# Altium schematic sheet TM2_MAIN.SchDoc
size A; DrawnBy: Eduardo
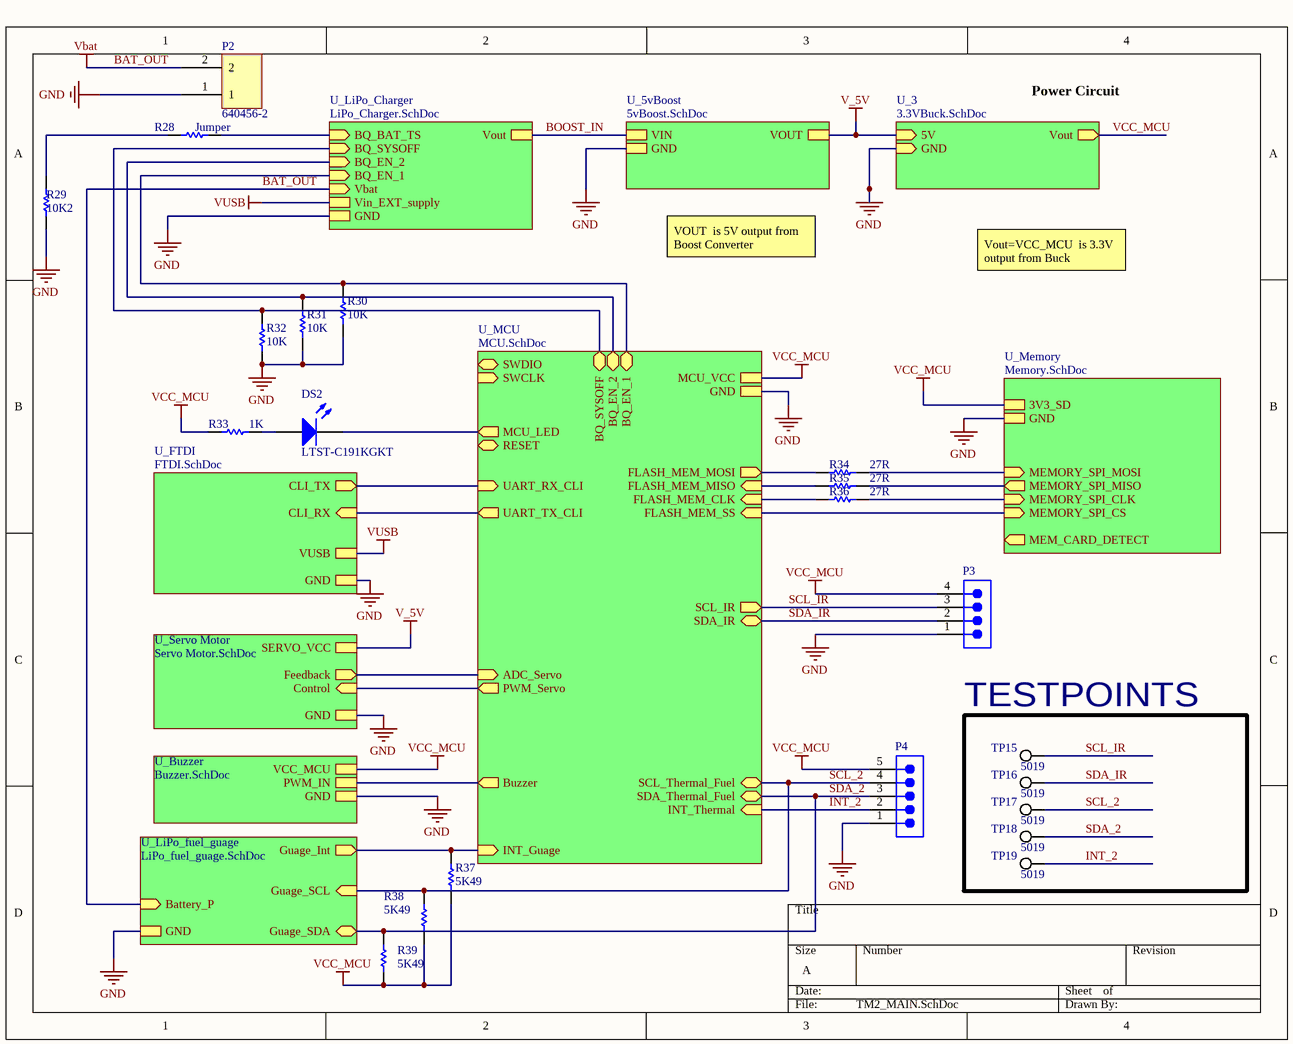
[diagram p0: TM2_MAIN.SchDoc]

## Parts
DS2  LTST-C191KGKT  [LITE-ON-LTST-C191KRKT-2_V]
P2  640456-2  [640456-2]
P3  (no value)  [SMTC-MTSW-104-07-X-S-170]
P4  (no value)  [SMTC-MTLW-105-05-X-S-190]
R28  Jumper  [RESC0603(1608)_N]
R29  10K2  [RESC0805(2012)_L]
R30  10K  [RESC0805(2012)_L]
R31  10K  [RESC0805(2012)_L]
R32  10K  [RESC0805(2012)_L]
R33  1K  [RESC0603(1608)_M]
R34  27R  [RESC0603(1608)_N]
R35  27R  [RESC0603(1608)_N]
R36  27R  [RESC0603(1608)_N]
R37  5K49  [RESC0805(2012)_N]
R38  5K49  [RESC0805(2012)_N]
R39  5K49  [RESC0805(2012)_N]
TP15  5019  [KSTN-5019_V]
TP16  5019  [KSTN-5019_V]
TP17  5019  [KSTN-5019_V]
TP18  5019  [KSTN-5019_V]
TP19  5019  [KSTN-5019_V]

## Blocks framed on the sheet
TESTPOINTS: TP15-TP19

## Sub-sheets
U_3 = 3.3VBuck.SchDoc: 5V (in), GND (in), Vout (out)
U_5vBoost = 5vBoost.SchDoc: VOUT, VIN, GND
U_Buzzer = Buzzer.SchDoc: VCC_MCU, GND, PWM_IN
U_FTDI = FTDI.SchDoc: CLI_RX (in), CLI_TX (out), VUSB, GND
U_LiPo_Charger = LiPo_Charger.SchDoc: BQ_BAT_TS (in), BQ_SYSOFF (in), BQ_EN_2 (in), BQ_EN_1 (in), Vbat (in), Vout, GND, Vin_EXT_supply
U_LiPo_fuel_guage = LiPo_fuel_guage.SchDoc: Guage_SDA (bidir), Guage_SCL (in), Guage_Int (out), Battery_P (in), GND
U_MCU = MCU.SchDoc: SWDIO (bidir), SWCLK (in), UART_TX_CLI (out), FLASH_MEM_SS (in), FLASH_MEM_CLK (in), FLASH_MEM_MISO (in), FLASH_MEM_MOSI (out), RESET (bidir), MCU_LED (out), MCU_VCC, GND, INT_Thermal (in), SDA_IR (bidir), PWM_Servo (out), ADC_Servo (in), SCL_Thermal_Fuel (bidir), SDA_Thermal_Fuel (bidir), SCL_IR (out), UART_RX_CLI (in), BQ_SYSOFF (bidir), BQ_EN_1 (bidir), BQ_EN_2 (bidir), INT_Guage (in), Buzzer (out)
U_Memory = Memory.SchDoc: MEMORY_SPI_MOSI (in), MEMORY_SPI_MISO (out), MEMORY_SPI_CLK (in), MEMORY_SPI_CS (in), MEM_CARD_DETECT (out), GND, 3V3_SD
U_Servo Motor = Servo Motor.SchDoc: SERVO_VCC, Feedback (out), Control (in), GND

## Nets
BAT_OUT: P2.2 ; sheet U_LiPo_Charger/Vbat, sheet U_LiPo_fuel_guage/Battery_P  [also labelled Vbat]
GND: P2.1 P3.1 P4.1 R29.1 R30.1 R31.2 R32.2 ; sheet U_FTDI/GND, sheet U_Memory/GND, sheet U_5vBoost/GND, sheet U_3/GND, sheet U_MCU/GND, sheet U_Servo Motor/GND, sheet U_LiPo_Charger/GND, sheet U_LiPo_fuel_guage/GND, sheet U_Buzzer/GND
V_5V: sheet U_5vBoost/VOUT, sheet U_3/5V, sheet U_Servo Motor/SERVO_VCC
VCC_MCU: P3.4 P4.5 R33.1 R37.1 R38.1 R39.1 ; sheet U_Memory/3V3_SD, sheet U_3/Vout, sheet U_MCU/MCU_VCC, sheet U_Buzzer/VCC_MCU
VUSB: sheet U_FTDI/VUSB, sheet U_LiPo_Charger/Vin_EXT_supply
BOOST_IN: sheet U_5vBoost/VIN, sheet U_LiPo_Charger/Vout
INT_2: P4.2 TP19.1 ; sheet U_MCU/INT_Thermal
SCL_2: P4.4 R38.2 TP17.1 ; sheet U_MCU/SCL_Thermal_Fuel, sheet U_LiPo_fuel_guage/Guage_SCL
SCL_IR: P3.3 TP15.1 ; sheet U_MCU/SCL_IR
SDA_2: P4.3 R39.2 TP18.1 ; sheet U_MCU/SDA_Thermal_Fuel, sheet U_LiPo_fuel_guage/Guage_SDA
SDA_IR: P3.2 TP16.1 ; sheet U_MCU/SDA_IR
NetDS2_1: DS2.1(A) R33.2
NetDS2_2: DS2.2(K) ; sheet U_MCU/MCU_LED
NetR28_1: R28.1 R29.2
NetR28_2: R28.2 ; sheet U_LiPo_Charger/BQ_BAT_TS
NetR30_2: R30.2 ; sheet U_MCU/BQ_EN_1, sheet U_LiPo_Charger/BQ_EN_1
NetR31_1: R31.1 ; sheet U_MCU/BQ_EN_2, sheet U_LiPo_Charger/BQ_EN_2
NetR32_1: R32.1 ; sheet U_MCU/BQ_SYSOFF, sheet U_LiPo_Charger/BQ_SYSOFF
NetR34_1: R34.1 ; sheet U_MCU/FLASH_MEM_MOSI
NetR34_2: R34.2 ; sheet U_Memory/MEMORY_SPI_MOSI
NetR35_1: R35.1 ; sheet U_MCU/FLASH_MEM_MISO
NetR35_2: R35.2 ; sheet U_Memory/MEMORY_SPI_MISO
NetR36_1: R36.1 ; sheet U_MCU/FLASH_MEM_CLK
NetR36_2: R36.2 ; sheet U_Memory/MEMORY_SPI_CLK
NetR37_2: R37.2 ; sheet U_MCU/INT_Guage, sheet U_LiPo_fuel_guage/Guage_Int
(unnamed): sheet U_FTDI/CLI_RX, sheet U_MCU/UART_TX_CLI
(unnamed): sheet U_FTDI/CLI_TX, sheet U_MCU/UART_RX_CLI
(unnamed): sheet U_Memory/MEMORY_SPI_CS, sheet U_MCU/FLASH_MEM_SS
(unnamed): sheet U_MCU/PWM_Servo, sheet U_Servo Motor/Control
(unnamed): sheet U_MCU/ADC_Servo, sheet U_Servo Motor/Feedback
(unnamed): sheet U_MCU/Buzzer, sheet U_Buzzer/PWM_IN

## Notes on the sheet
- Power Circuit
- VOUT  is 5V output from Boost Converter
- Vout=VCC_MCU  is 3.3V output from Buck Converter

## Library data of the parts
DS2 = CMP-2000-05198-1: Chip LED, Green, 574 nm, 40 pF, -55 to 85 degC, 2-Pin SMD, RoHS, Tape and Reel; Manufacturer: Lite-On; Rad Hardened: No; Emitting Color: YellowGreen; Product Height (mm): 0.55mm; Forward Voltage: 2.4V; Number of Elements: 1; Dominant Wave Length: 571nm; DELETED: Compliant; Viewing Angle: 130deg; High Brightness: Yes; Peak Wavelength: 574nm; Type: Uni-Color; Forward Current: 30mA; Product Length (mm): 1.6mm; Luminous Intensity: 35mcd; Test Current (It): 20mA; Chip Material: AlGaInP; Product Depth (mm): 0.8mm; Shape Type: Rectangular; Reverse Voltage: 5V; Power Dissipation: 75W; Pin Count: 2; Lens Dimensions: 1.1X0.8X0.37mm; Packaging: TapeandReel; Main Category: ChipLED; Operating Temperature Classification: Industrial; Package Type: ChipLed; Mounting: SurfaceMount; Lum Intensity: 35mcd; Operating Temp Range: -55Cto85C; Datasheet Version: Jan-07; Datasheet URL: http://download.siliconexpert.com/pdfs/2007/08/26/semi_b/manual/lot/ds/ltst-c191kgkt.pdf; Manufacturer URL: http://www.us.liteon.com/
P2 = 640456-2: CONN HEADER VERT 2POS .100 TIN; Manufacturer: TE Connectivity; Underplate Material: Nickel; Connector Type: Plug,Pin,Header; Contact Resistance: 6mR; Max Current Rating: 5A; Max Voltage Rating (AC): 250V; Number of Positions: 2; Backwall/Post Interruptions: No (Without); Connector System: Wire-to-Board; Plating Thickness: 3.81um; PCB Mount Retention: Without; Gender: Male; Contact Style: Straight; PCB Mounting Orientation: Vertical; Pitch: 2.54mm; Mating Post Length: 7.49mm; PCB Thickness: 0.063inch; Tail Length: 3.56mm; Approvals: CSA; Supplier 1: Digi-Key; Manufacturer Part Number: 640456-2; Stock 1: 141304; Pricing 1: 1=0.12, 10=0.117, 100=0.0724, 500=0.0599, 1000=0.0524, 5000=0.0449, 10000=0.0437 (USD); Mount: Through Hole; Colour: White,Natural,Beige; Contact Plating: Tin; Contact Material: Copper Alloy; Housing Colour: Natural; Housing Material: Polyester; Contact Shape: Square; Min Operating Temperature: -67°C; Max Operating Temperature: 221°C; Package Quantity: 5000; Packaging: Bulk; Termination: Solder; Number of Rows: 1; Fastening Type: Friction; Contact Gender: Male; Voltage Rating (AC): 250V; Number of Contacts: 2; Orientation: Straight; Contact Retention: No (Without); Mating Alignment: No (Without); Mating Retention: No (Without); PCB Mount Alignment: No (Without); Panel Mount Retention: No (Without); Sealable: No (Without); Strain Relief: No (Without); Current Rating: 5A; Number of Poles: 2; Voltage Rating: 250V; Working Voltage: 250V; Length: 5.08mm; Height: 7.87mm; Depth: 5.72mm; Lead Pitch: 2.54mm; Contact Mating Length: 0.295inch; Termination Post Length: 3.56mm; Radiation Hardening: No; ELV: Compliant; Lead Free: Lead Free; Flammability Rating: UL94 V-0; REACH SVHC: No SVHC; ComponentLink1URL: https://datasheet.ciiva.com/709/eng-cd-640456-w1-709680.pdf; ComponentLink1Description: https://datasheet.ciiva.com/709/eng-cd-640456-w1-709680.pdf; ComponentLink2URL: https://datasheet.ciiva.com/3118/eng-ds-82056-mta-0608-3118497.pdf; ComponentLink2Description: https://datasheet.ciiva.com/3118/eng-ds-82056-mta-0608-3118497.pdf; ComponentLink3URL: https://datasheet.ciiva.com/19462/613931-19462481.pdf; ComponentLink3Description: https://datasheet.ciiva.com/19462/613931-19462481.pdf; ComponentLink4URL: https://datasheet.ciiva.com/14156/04384301-14156820.pdf; ComponentLink4Description: https://datasheet.ciiva.com/14156/04384301-14156820.pdf; ComponentLink5URL: https://datasheet.ciiva.com/7128/1866390-7128742.pdf; ComponentLink5Description: https://datasheet.ciiva.com/7128/1866390-7128742.pdf; ComponentLink6URL: https://datasheet.ciiva.com/16401/eng-ds-82056-mta-0608-16401289.pdf; ComponentLink6Description: https://datasheet.ciiva.com/16401/eng-ds-82056-mta-0608-16401289.pdf; ComponentLink7URL: https://datasheet.ciiva.com/16505/eng-ds-82056-mta-0608-16505419.pdf; ComponentLink7Description: https://datasheet.ciiva.com/16505/eng-ds-82056-mta-0608-16505419.pdf; ComponentLink8URL: https://datasheet.ciiva.com/25617/0900766b80027008-25617244.pdf; ComponentLink8Description: https://datasheet.ciiva.com/25617/0900766b80027008-25617244.pdf; ComponentLink9URL: https://datasheet.ciiva.com/11746/0900766b80eb7fdd-11746365.pdf; ComponentLink9Description: https://datasheet.ciiva.com/11746/0900766b80eb7fdd-11746365.pdf; Supplier Part Number 1: A1921-ND
P3 = CMP-1024-00107-1: Manufacturer: Samtec; PartNumber: MTSW-104-07-L-S-170; Pitch: 2.54 mm; PackageVersion: BI, 2/1987; ComponentLink1URL: http://www.samtec.com; PackageReference: MTSW-104-07-X-S-170; ComponentLink3Description: Package Specification; Temperature Range: -55 to 125 degC; ComponentLink2URL: http://www.samtec.com/documents/webfiles/pdf/MTSW.PDF; RoHS: True; Orientation: Vertical; DatasheetVersion: F-214; Mounting Technology: Through-hole; ComponentLink1Description: Manufacturer URL; ComponentLink2Description: Datasheet; ComponentLink3URL: http://www.samtec.com/documents/webfiles/cpdf/MTSW-XXX-XX-X-X-XXXX-XX-XXX-MKT1.pdf
P4 = CMP-1024-00079-1: Manufacturer: Samtec; PartNumber: MTLW-105-05-L-S-190; Pitch: 2.54 mm; Mounting Technology: Through-hole; ComponentLink2Description: Datasheet; DatasheetVersion: F-214; Temperature Range: -55 to 125 degC; ComponentLink1Description: Manufacturer URL; Orientation: Vertical; ComponentLink2URL: http://www.samtec.com/documents/webfiles/pdf/MTLW_TH.PDF; PackageDescription: Low Profile Terminal Assembly; PackageVersion: T, 6/1991; RoHS: True; ComponentLink3Description: Package Specification; ComponentLink1URL: http://www.samtec.com; PackageReference: MTLW-105-05-X-S-190; ComponentLink3URL: http://www.samtec.com/documents/webfiles/cpdf/MTLW-1XX-XX-XX-X-XXX-XX-XX-MKT1.pdf
R28 = CMP-1012-00001-1: Jumper 0603 (1608 Metric); Case-Metric: 1608; Value: 0.00 Ohm; Power: None; Case-EIA: 0603; Technology: SMT; Tolerance: None
R29-R32 = CMP-1013-00624-1: 10K2 0.125W 1% 0805 (2012 Metric)  SMD; Case-Metric: 2012; Case-EIA: 0805; Value: 10200.00 Ohm; Technology: SMT; Tolerance: 1 %; Power: 0.125 W
R33 = CMP-1012-00510-1: 1K 0.1W 1% 0603 (1608 Metric)  SMD; Case-Metric: 1608; Case-EIA: 0603; Value: 1000.00 Ohm; Technology: SMT; Tolerance: 1 %; Power: 0.1 W
R34-R36 = CMP-1012-00331-1: 27R 0.1W 1% 0603 (1608 Metric)  SMD; Case-EIA: 0603; Value: 27.00 Ohm; Case-Metric: 1608; Technology: SMT; Tolerance: 1 %; Power: 0.1 W
R37-R39 = CMP-1013-00594-1: 5K49 0.125W 1% 0805 (2012 Metric)  SMD; Case-Metric: 2012; Value: 5490.00 Ohm; Case-EIA: 0805; Tolerance: 1 %; Power: 0.125 W; Technology: SMT
TP15-TP19 = CMP-1672-00008-1: Test Point, 1 Position SMD, RoHS, Tape and Reel; ComponentLink1Description: Manufacturer URL; Package Quantity: 1000; DatasheetVersion: 03/2014; Packaging: Tape and Reel; ComponentLink2URL: http://www.keyelco.com/product-pdf.cfm?p=1357; ComponentLink1URL: http://www.keyelco.com/; Mount: Surface Mount; Contact Plating: Silver; PackageDescription: 1-Pin Surface Mount Device, Body 3.81 x 2.03 mm; Pins: 1; RoHSCompliant: True; Mounting Technology: Surface Mount; ComponentLink2Description: Datasheet; PackageReference: 5019